# EAGLE design Duinopeak Shield Bot v0.9 (EAGLE 6.2)
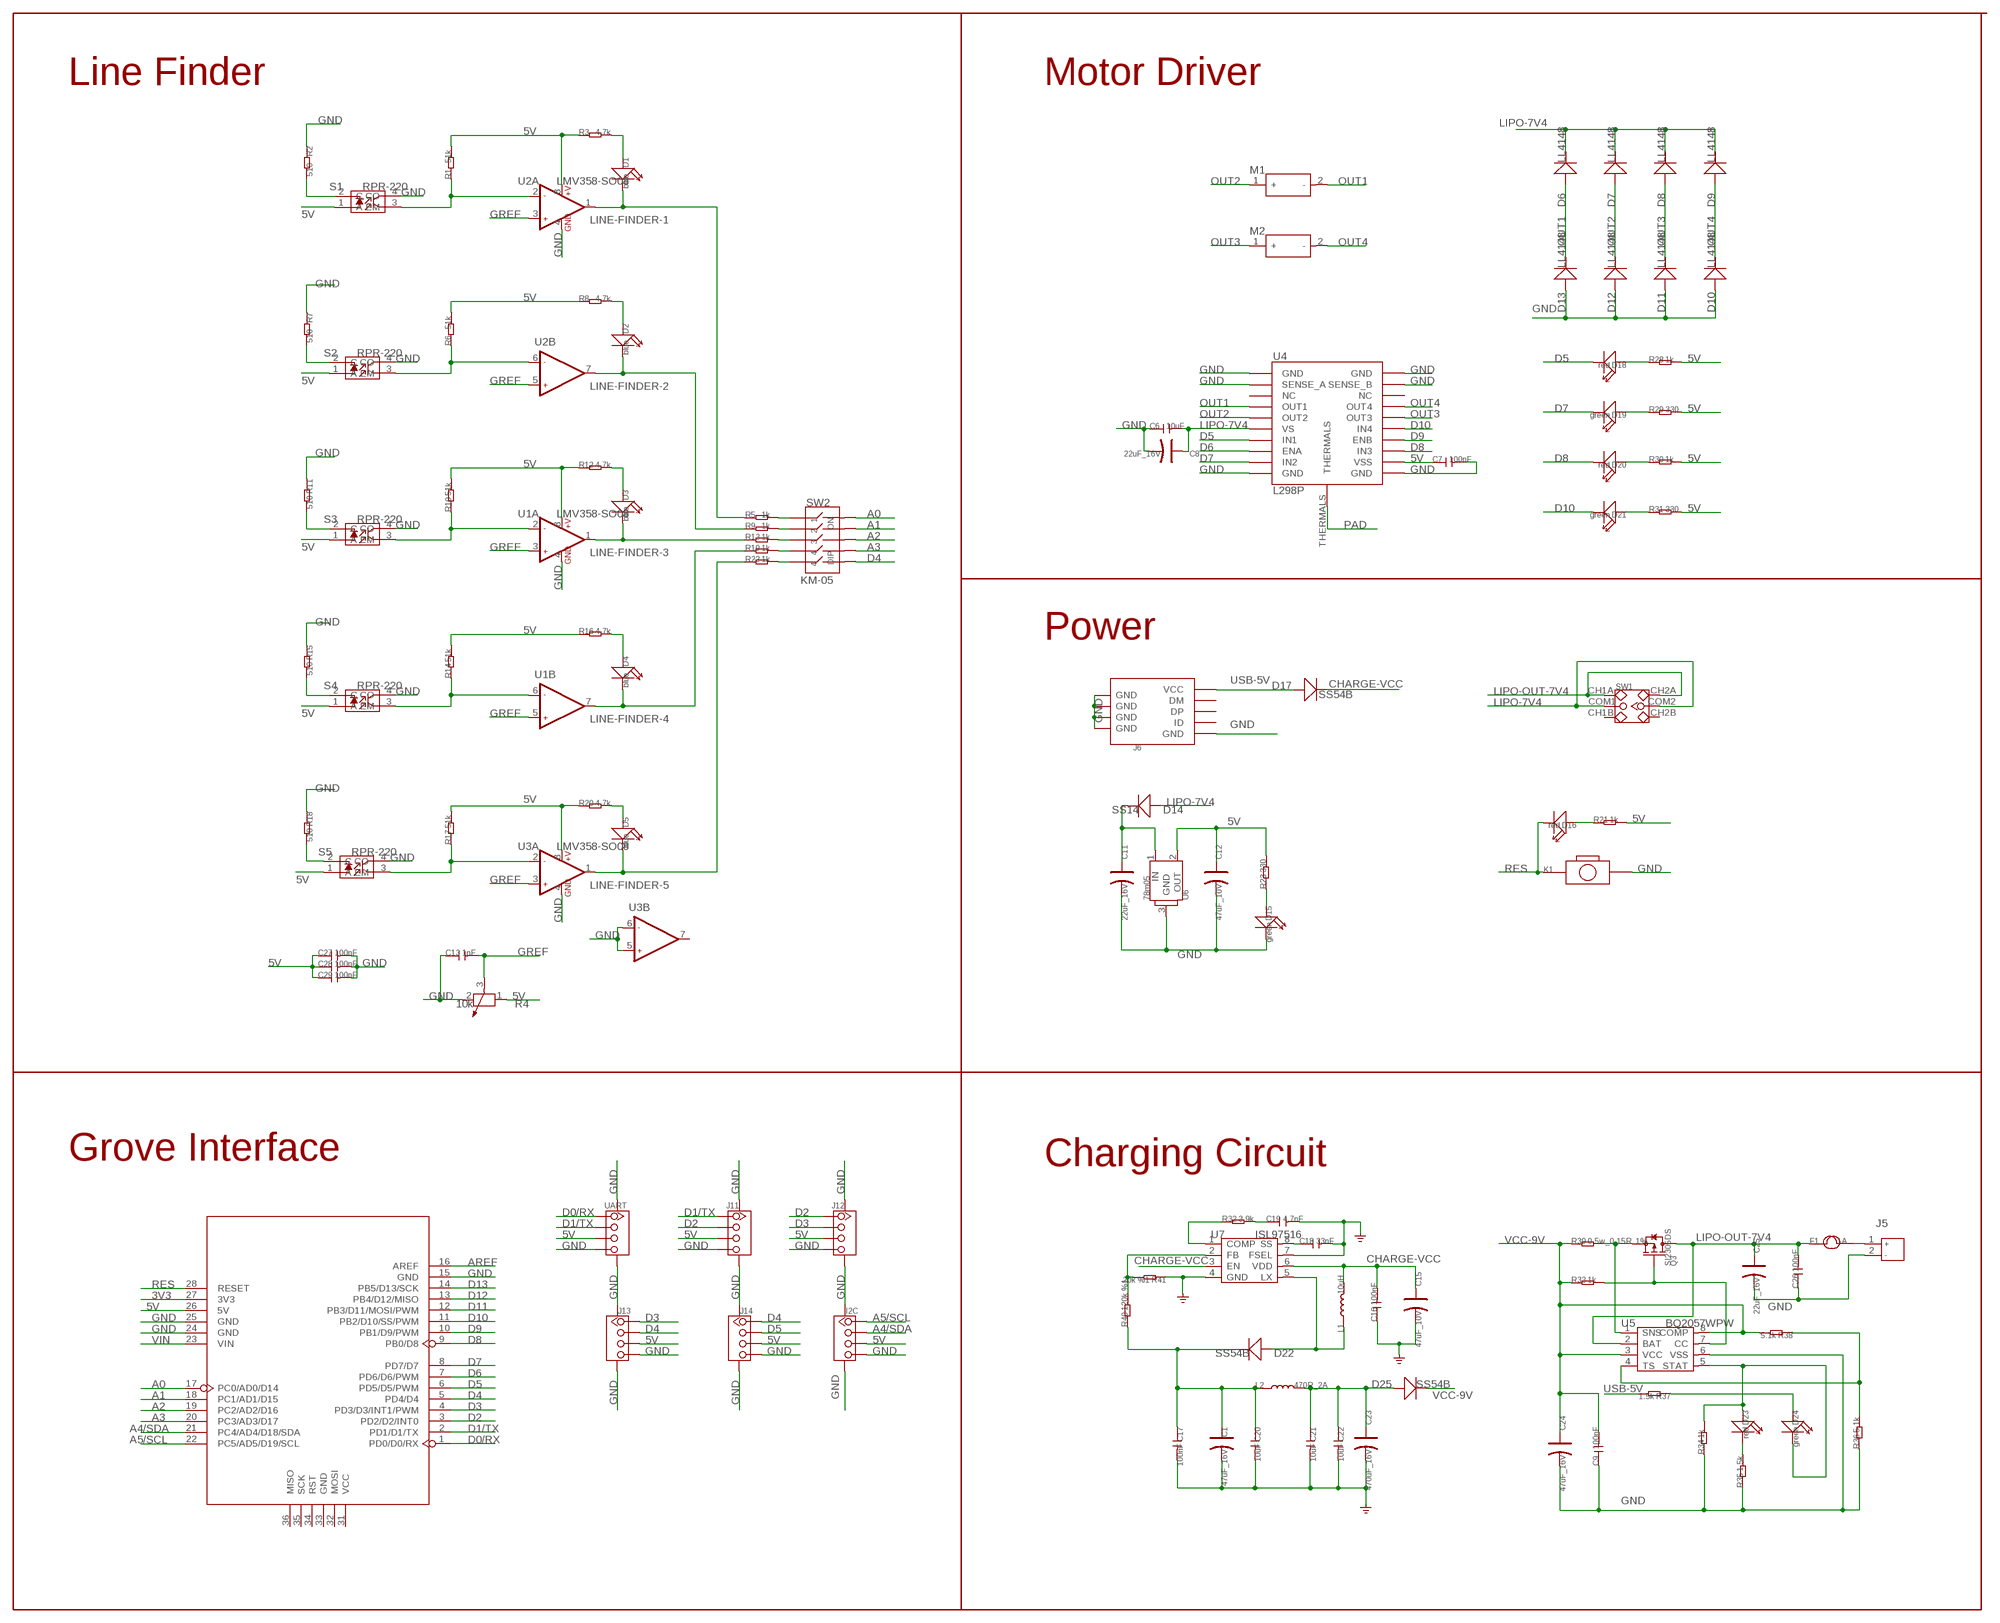
[diagram p0: schematic, sheet 1]

## Parts
C1  47uF_16V  CAP-AVX-C  [AVX-C]
C6  10uF  C-0603  [C0603]
C7  100nF  C-0603  [C0603]
C8  22uF_16V  CAP-AVX-B  [AVX-B]
C9  100nF  C-0603  [C0603]
C11  22uF_16V  CAP-AVX-B  [AVX-B]
C12  47uF_10V  CAP-AVX-B  [AVX-B]
C13  1nF  C-0603  [C0603]
C15  47uF_10V  CAP-AVX-B  [AVX-B]
C16  100nF  C-0603  [C0603]
C17  100nF  C-0603  [C0603]
C18  33nF  C-0603  [C0603]
C19  4.7nF  C-0603  [C0603]
C20  10uF  C-0603  [C0603]
C21  10uF  C-0603  [C0603]
C22  10uF  C-0603  [C0603]
C23  470uF_16V  CAP-AVX-E  [AVX-E]
C24  47uF_16V  CAP-AVX-C  [AVX-C]
C25  22uF_16V  CAP-AVX-B  [AVX-B]
C26  100nF  C-0603  [C0603]
C27  100nF  C-0603  [C0603]
C28  100nF  C-0603  [C0603]
C29  100nF  C-0603  [C0603]
D1  blue  LED'0603'  [LED-0603]
D2  blue  LED'0603'  [LED-0603]
D3  blue  LED'0603'  [LED-0603]
D4  blue  LED'0603'  [LED-0603]
D5  blue  LED'0603'  [LED-0603]
D6  LL4148  D'1206'  [SOD123]
D7  LL4148  D'1206'  [SOD123]
D8  LL4148  D'1206'  [SOD123]
D9  LL4148  D'1206'  [SOD123]
D10  LL4148  D'1206'  [SOD123]
D11  LL4148  D'1206'  [SOD123]
D12  LL4148  D'1206'  [SOD123]
D13  LL4148  D'1206'  [SOD123]
D14  SS14  D'SMA'  [D2010]
D15  green  LED'0603'  [LED-0603]
D16  red  LED'0603'  [LED-0603]
D17  SS54B  D'MBRS240LT3'  [SMB]
D18  red  LED'0603'  [LED-0603]
D19  green  LED'0603'  [LED-0603]
D20  red  LED'0603'  [LED-0603]
D21  green  LED'0603'  [LED-0603]
D22  SS54B  D'MBRS240LT3'  [SMB]
D23  red  LED'0603'  [LED-0603]
D24  green  LED'0603'  [LED-0603]
D25  SS54B  D'MBRS240LT3'  [SMB]
F1  1A  FUSE  [1812]
I2C  TWIG-4P-2.0-SMD-FEMALE-REINFORCE'90D'  [4P-SMD-2.0-90D]
J5  JACK-JST-2P-PW'2.0'  [JST-2.0]
J6  USB-MINIUSB-5P-STRONG  [MINI-SMD-5P]
J11  TWIG-4P-2.0-SMD-FEMALE-REINFORCE'90D'  [4P-SMD-2.0-90D]
J12  TWIG-4P-2.0-SMD-FEMALE-REINFORCE'90D'  [4P-SMD-2.0-90D]
J13  TWIG-4P-2.0-SMD-FEMALE-REINFORCE'90D'  [4P-SMD-2.0-90D]
J14  TWIG-4P-2.0-SMD-FEMALE-REINFORCE'90D'  [4P-SMD-2.0-90D]
K1  BOTTON-2P-90D  [2P-7.62X3.56-90D]
L1  10uH  L'IHLP-2525BD-01'  [2626]
L2  470R_2A  L'0805'  [L0805]
M1  MOTOR-2P-PAD  [2P-SMD-27X26]
M2  MOTOR-2P-PAD  [2P-SMD-27X26]
Q3  SI2305DS  MOSFET-P'SI2323CDS/SI2305DS<BR>'  [SOT23]
R1  51k  R-0603  [R0603]
R2  510  R-0603  [R0603]
R3  4.7k  R-0603  [R0603]
R4  10k  R-POTENTIOMETER'3362'  [3P-SQUA-7X6.8]
R5  1k  R-0603  [R0603]
R6  51k  R-0603  [R0603]
R7  510  R-0603  [R0603]
R8  4.7k  R-0603  [R0603]
R9  1k  R-0603  [R0603]
R10  51k  R-0603  [R0603]
R11  510  R-0603  [R0603]
R12  4.7k  R-0603  [R0603]
R13  1k  R-0603  [R0603]
R14  51k  R-0603  [R0603]
R15  510  R-0603  [R0603]
R16  4.7k  R-0603  [R0603]
R17  51k  R-0603  [R0603]
R18  510  R-0603  [R0603]
R19  1k  R-0603  [R0603]
R20  4.7k  R-0603  [R0603]
R21  1k  R-0603  [R0603]
R22  1k  R-0603  [R0603]
R23  330  R-0603  [R0603]
R28  1k  R-0603  [R0603]
R29  330  R-0603  [R0603]
R30  1k  R-0603  [R0603]
R31  330  R-0603  [R0603]
R32  3.9k  R-0603  [R0603]
R33  1k  R-0603  [R0603]
R34  1k  R-0603  [R0603]
R35  1.5k  R-0603  [R0603]
R36  5.1k  R-0603  [R0603]
R37  1.5k  R-0603  [R0603]
R38  5.1k  R-0603  [R0603]
R39  0.5w_0.15R 1%  R-2512  [R2512]
R40  120k %1  R-0603  [R0603]
R41  20k %1  R-0603  [R0603]
S1  RPR-220  REFLECTIVE-PHOTOSENSOR-RPR-220  [4P-6.4X4.9X6.5H]
S2  RPR-220  REFLECTIVE-PHOTOSENSOR-RPR-220  [4P-6.4X4.9X6.5H]
S3  RPR-220  REFLECTIVE-PHOTOSENSOR-RPR-220  [4P-6.4X4.9X6.5H]
S4  RPR-220  REFLECTIVE-PHOTOSENSOR-RPR-220  [4P-6.4X4.9X6.5H]
S5  RPR-220  REFLECTIVE-PHOTOSENSOR-RPR-220  [4P-6.4X4.9X6.5H]
SW1  SWITCH-2CH-6P'90D'  [6P-2CH-2.54-9.0X3.6-90D]
SW2  KM-05  SWITCH-KM-05-10P  [10P-SMD-14.2X6.8]
U1  LMV358-SO08  [SO08]
U2  LMV358-SO08  [SO08]
U3  LMV358-SO08  [SO08]
U4  L298P  L298_BRIDGE_DRIVER  [POWERSO20]
U5  BQ2057WPW  [TSSOP8]
U6  78m05  78M05-TO252  [TO252]
U7  ISL97516  [MSOP8]
U13  ARDUINO  [ARDUINO]
UART  TWIG-4P-2.0-SMD-FEMALE-REINFORCE'90D'  [4P-SMD-2.0-90D]

## Nets
3V3: U13.27(3V3)
5V: C7.1 C12.+ C27.1 C28.1 C29.1 I2C.3 J11.3 J12.3 J13.3 J14.3 R1.2 R3.1 R4.1 R6.2 R8.1 R10.2 R12.1 R14.2 R16.1 R17.2 R20.1 R21.2 R23.2 R28.2 R29.2 R30.2 R31.2 S1.1(A) S2.1(A) S3.1(A) S4.1(A) S5.1(A) U1.8(A:+V) U2.8(A:+V) U3.8(A:+V) U4.P$12(VSS) U6.2(OUT) U13.26(5V) UART.3
A0: SW2.10 U13.17(PC0/AD0/D14)
A1: SW2.9 U13.18(PC1/AD1/D15)
A2: SW2.8 U13.19(PC2/AD2/D16)
A3: SW2.7 U13.20(PC3/AD3/D17)
A4/SDA: I2C.2 U13.21(PC4/AD4/D18/SDA)
A5/SCL: I2C.1 U13.22(PC5/AD5/D19/SCL)
AREF: U13.16(AREF)
CHARGE-VCC: C15.+ C16.2 D17.- L1.2 U7.3(EN) U7.6(VDD)
D0/RX: U13.1(PD0/D0/RX) UART.1
D1/TX: J11.1 U13.2(PD1/D1/TX) UART.2
D2: J11.2 J12.1 U13.3(PD2/D2/INT0)
D3: J12.2 J13.1 U13.4(PD3/D3/INT1/PWM)
D4: J13.2 J14.1 SW2.6 U13.5(PD4/D4)
D5: D18.- J14.2 U4.P$7(IN1) U13.6(PD5/D5/PWM)
D6: U4.P$8(ENA) U13.7(PD6/D6/PWM)
D7: D19.- U4.P$9(IN2) U13.8(PD7/D7)
D8: D20.- U4.P$13(IN3) U13.9(PB0/D8)
D9: U4.P$14(ENB) U13.10(PB1/D9/PWM)
D10: D21.- U4.P$15(IN4) U13.11(PB2/D10/SS/PWM)
D11: U13.12(PB3/D11/MOSI/PWM)
D12: U13.13(PB4/D12/MISO)
D13: U13.14(PB5/D13/SCK)
GND: C1.- C6.1 C7.2 C8.- C9.1 C11.- C12.- C13.1 C15.- C16.1 C17.2 C18.2 C19.2 C20.2 C21.2 C22.2 C23.- C24.- C25.- C26.1 C27.2 C28.2 C29.2 D10.+ D11.+ D12.+ D13.+ D15.- I2C.4 I2C.SS1 I2C.SS2 J5.2 J6.5(GND) J6.GND@1(GND) J6.GND@2(GND) J6.GND@3(GND) J6.GND@4(GND) J11.4 J11.SS1 J11.SS2 J12.4 J12.SS1 J12.SS2 J13.4 J13.SS1 J13.SS2 J14.4 J14.SS1 J14.SS2 K1.P$2 R2.1 R4.2 R7.1 R11.1 R15.1 R18.1 R34.1 R35.1 R36.1 R41.1 S1.4(CO) S2.4(CO) S3.4(CO) S4.4(CO) S5.4(CO) U1.4(A:GND) U2.4(A:GND) U3.4(A:GND) U3.5(B:+IN2) U3.6(B:-IN2) U4.P$1(GND) U4.P$2(SENSE_A) U4.P$10(GND) U4.P$11(GND) U4.P$19(SENSE_B) U4.P$20(GND) U5.6(VSS) U6.3(GND) U7.4(GND) U7.7(FSEL) U13.15(GND) U13.24(GND) U13.25(GND) UART.4 UART.SS1 UART.SS2
GREF: C13.2 R4.3 U1.3(A:+IN1) U1.5(B:+IN2) U2.3(A:+IN1) U2.5(B:+IN2) U3.3(A:+IN1)
LINE-FINDER-1: D1.- R5.1 U2.1(A:OUT1)
LINE-FINDER-2: D2.- R9.1 U2.7(B:OUT2)
LINE-FINDER-3: D3.- R13.1 U1.1(A:OUT1)
LINE-FINDER-4: D4.- R19.1 U1.7(B:OUT2)
LINE-FINDER-5: D5.- R22.1 U3.1(A:OUT1)
LIPO-7V4: C6.2 C8.+ D6.- D7.- D8.- D9.- D14.+ SW1.COM1 SW1.COM2 U4.P$6(VS)
LIPO-OUT-7V4: C25.+ C26.2 F1.1 Q3.3(D) SW1.CH1A SW1.CH2A U5.2(BAT)
N$1: D18.+ R28.1
N$2: R1.1 S1.3(EM) U2.2(A:-IN1)
N$3: R6.1 S2.3(EM) U2.6(B:-IN2)
N$4: D2.+ R8.2
N$5: R2.2 S1.2(C)
N$6: R7.2 S2.2(C)
N$7: D19.+ R29.1
N$8: R10.1 S3.3(EM) U1.2(A:-IN1)
N$9: D3.+ R12.2
N$10: R11.2 S3.2(C)
N$11: D20.+ R30.1
N$12: D1.+ R3.2
N$13: R15.2 S4.2(C)
N$14: D4.+ R16.2
N$15: R5.2 SW2.1
N$16: F1.2 J5.1
N$17: R9.2 SW2.2
N$18: D5.+ R20.2
N$19: R18.2 S5.2(C)
N$20: R17.1 S5.3(EM) U3.2(A:-IN1)
N$21: R13.2 SW2.3
N$22: R19.2 SW2.4
N$23: R22.2 SW2.5
N$25: D16.+ R21.1
N$28: D21.+ R31.1
N$31: D15.+ R23.1
N$32: Q3.2(S) R39.2 U5.1(SNS)
N$33: R14.1 S4.3(EM) U1.6(B:-IN2)
N$35: Q3.1(G) R33.2 U5.7(CC)
N$36: D23.- R35.2
N$37: R36.2 R38.1 U5.4(TS)
N$38: D23.+ D24.- R34.2 U5.5(STAT)
N$39: D24.+ R37.1
N$41: C18.1 U7.8(SS)
N$42: R40.2 R41.2 U7.2(FB)
N$43: D22.+ L1.1 U7.5(LX)
N$44: R32.1 U7.1(COMP)
N$45: C19.1 R32.2
N$50: C11.+ D14.- U6.1(IN)
OUT1: D6.+ D13.- M1.2(-) U4.P$4(OUT1)
OUT2: D7.+ D12.- M1.1(+) U4.P$5(OUT2)
OUT3: D8.+ D11.- M2.1(+) U4.P$16(OUT3)
OUT4: D9.+ D10.- M2.2(-) U4.P$17(OUT4)
OUTPUT: C1.+ C17.1 C20.1 D22.- L2.1 R40.1
OUTPUT2: C21.1 C22.1 C23.+ D25.+ L2.2
PAD: U4.THERMALS
RES: D16.- K1.P$1 U13.28(RESET)
USB-5V: D17.+ J6.1(VCC) R37.2
VCC-9V: C9.2 C24.+ D25.- R33.1 R38.2 R39.1 U5.3(VCC) U5.8(COMP)
VIN: U13.23(VIN)
Unconnected: J6.2(DM) J6.3(DP) J6.4(ID) SW1.CH1B SW1.CH2B U3.7(B:OUT2) U4.P$3(NC) U4.P$18(NC) U13.31(VCC) U13.32(MOSI) U13.33(GND) U13.34(RST) U13.35(SCK) U13.36(MISO)

## Notes on the sheet
- Line Finder | Motor Driver
- Power
- Grove Interface | Charging Circuit

## Library data of the parts
C1 C8 C11 C12 C15 C23-C25 = Discrete:CAP*: Electrolytic Capacitors,Tantalum Capacitors and Super Capacitors
C6 C7 C9 C13 C16-C22 C26-C29 = Discrete:C*: Ceramic Capacitors
D1-D5 D15 D16 D18-D21 D23 D24 = Discrete:LED*
D6-D14 D17 D22 D25 = Discrete:D*
F1 = Discrete:FUSE
I2C J11-J14 UART = Connector:TWIG-4P-2.0-SMD-FEMALE-REINFORCE
J5 = Connector:JACK-JST-2P-PW
J6 = Connector:USB-MINIUSB-5P
K1 = Discrete:BOTTON-2P
L1 L2 = Discrete:L*
M1 M2 = template:MOTOR-2P-PAD
Q3 = Discrete:MOSFET-P
R1-R3 R5-R23 R28-R41 = Discrete:R*
R4 = Discrete:R-POTENTIOMETER*: Potentiometer
S1-S5 = Discrete:REFLECTIVE-PHOTOSENSOR-RPR-220: http://wenku.baidu.com/view/18864e7d27284b73f24250aa.html
SW1 = Discrete:SWITCH-2CH-6P
SW2 = template:SWITCH-KM-05-10P
U1-U3 = IC:LMV358: General purpose LOW Voltage, Rail-to-Rail Output Amplifiers http://www.fairchildsemi.com/ds/LM/LMV358.pdf
U4 = ICs:L298_BRIDGE_DRIVER
U5 = template:BQ2057W: Advanced Linear Charge Management IC For Single-AND TWO-CELL Lithium-Ion And Lithium-Polymer
U6 = IC:78M05: 0.5A Three Terminal Positive Voltage Regulators http://pdf1.alldatasheet.com/datasheet-pdf/view/31368/TOSHIBA/78M05/+21_79UPLRhpDDdCDytD+/datasheet.pdf
U7 = IC:ISL97516
U13 = moudle:ARDUINO

## Net classes
0 default: width 0.203 mm, drill 0.305 mm, clearance 0.127 mm

## Board
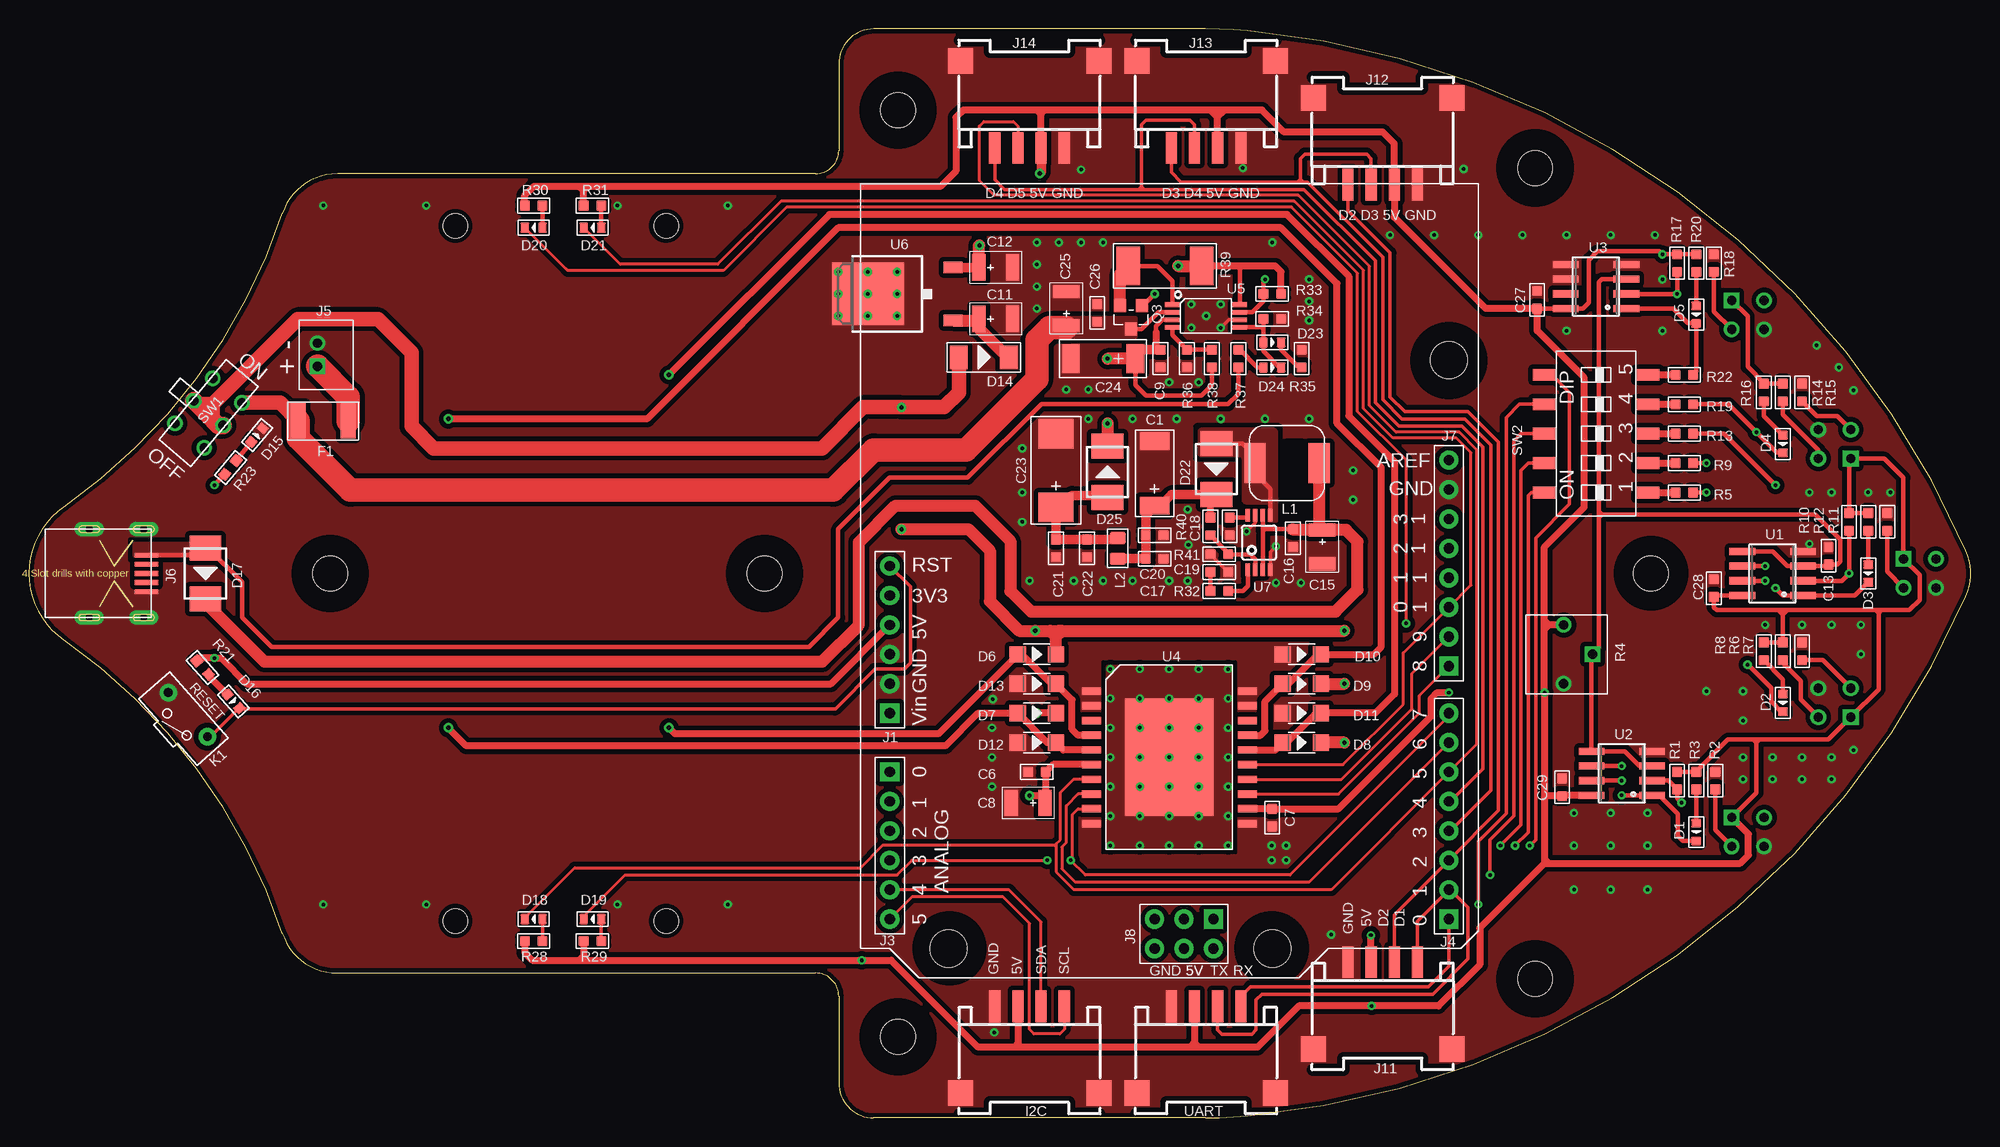
[diagram p1: board, top side]
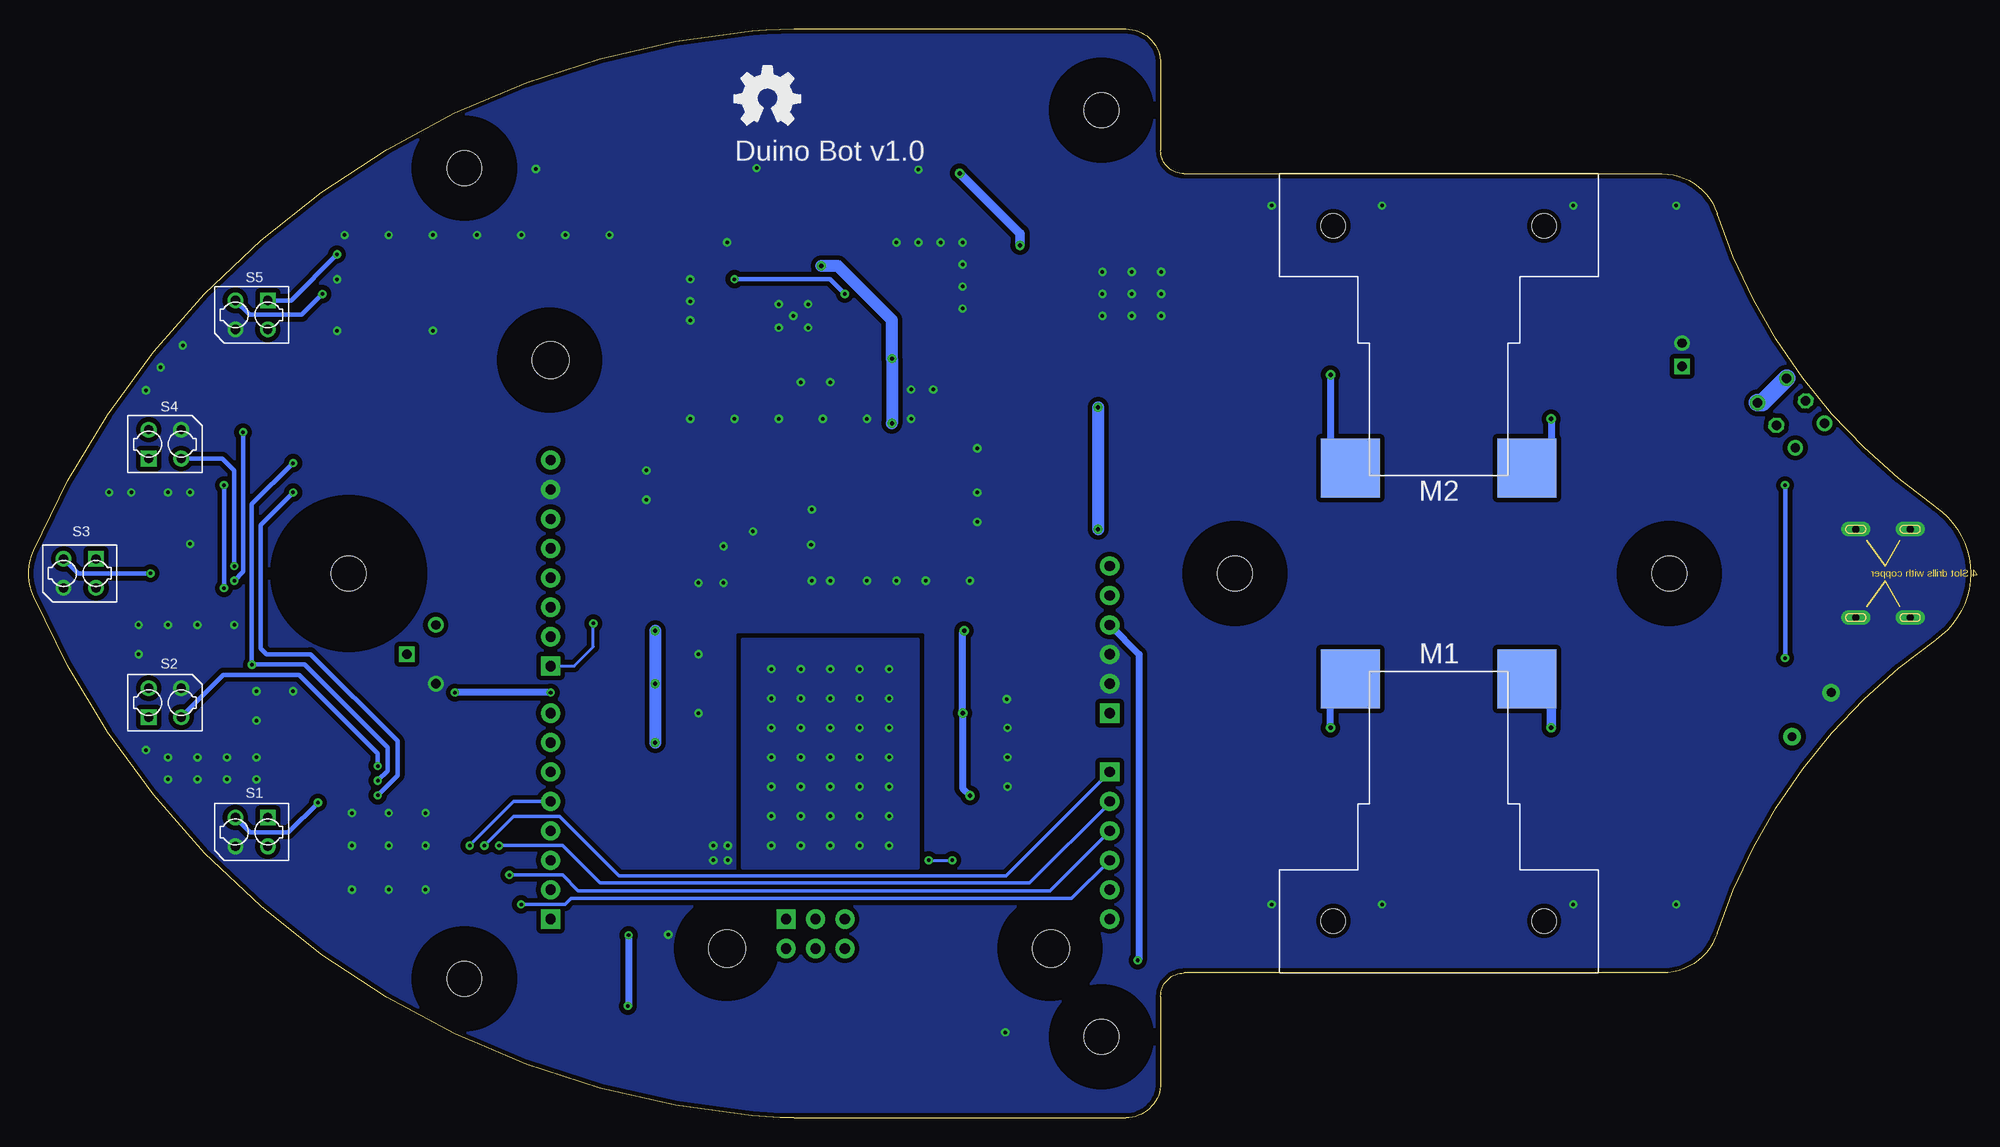
[diagram p2: board, bottom side, seen from below]

Size 167.58 x 94 mm. Coordinates in mm from the lower left corner, seen from the top.
Outline: 67.9,81.5 26.62,81.5 arc72 21.88,78.07 arc-37 3,52.74 arc110 3,41.26 arc-37 21.88,15.93 arc72 26.62,12.5 67.9,12.5 arc-90 69.9,10.5 69.9,3 arc90 72.9,0 101.53,0 arc5 105.15,0.16 arc61 167.17,45.01 arc47 167.17,48.99 arc61 105.15,93.84 arc5 101.53,94 72.9,94 arc90 69.9,91 69.9,83.5 arc-90 67.9,81.5
Copper layers (1*16): Top 0.035mm / dielectric 1.5mm / Bottom 0.035mm
Design rules "default": minimum track width 10mil, minimum drill 12mil, track to track 8mil, track to pad 8mil, pad to pad 8mil, via to via 8mil, smd to smd 0mil, copper to edge 10mil, drill to drill 8mil, minimum pad ring 10mil, minimum via ring 8mil, stop-mask expansion 4mil, vias tented up to drill 100mil, thermal gap 10mil
Holes 2.1 mm at 36.8,77 55,77 36.8,17 55,17
Holes 3 mm at 26,47 63.5,47 75,87 130,82 130,12 75,7 140,47
tRestrict: area 137.2,44.2 to 142.8,49.8; area 60.7,44.2 to 66.3,49.8; area 72.2,4.2 to 77.8,9.8; area 127.2,9.2 to 132.8,14.8; area 72.2,84.2 to 77.8,89.8; area 127.2,79.2 to 132.8,84.8; area 23.2,44.2 to 28.8,49.8; area 76.8,12 to 82.1,17.3; area 104.6,12 to 109.9,17.3; area 119.8,62.6 to 125.4,68.2; area 108.6,51.9 to 109.9,58.2
bRestrict: area 133.6,40.6 to 146.3,53.3; area 22,43 to 30,51; area 71,83 to 79,91; area 126,78 to 134,86; area 59.5,43 to 67.5,51; area 71,3 to 79,11; area 126,8 to 134,16; area 75.4,10.6 to 83.4,18.6; area 103.4,10.6 to 111.4,18.6; area 118.6,61.4 to 126.6,69.4

### Footprints (pad centres in the part's own frame; a part is rotated, then mirrored left to right if it is on the bottom)
AVX-C = smd 1.524 x 2.54: + -2.794,0; - 2.794,0
C0603 = smd 0.889 x 0.889: 1 -0.762,0; 2 0.762,0
AVX-B = smd 1.143 x 2.286: + -1.46,0; - 1.46,0
AVX-E = smd 2.54 x 3.048: + -3.175,0; - 3.175,0
LED-0603 = smd 0.762 x 0.889: + -0.762,0; - 0.762,0
SOD123 = smd 1.397 x 1.397: + -1.651,0; - 1.651,0
D2010 = smd 1.524 x 2.032: + -2.159,0; - 2.159,0
SMB = smd 2.159 x 2.743: + -2.21,0; - 2.21,0
1812 = smd 1.27 x 3.048: 1 -2.159,0; 2 2.159,0
4P-SMD-2.0-90D = smd 0.965 x 2.74: 1 -3,-0.1; 2 -1,-0.1; 3 1,-0.1; 4 3,-0.1 | smd 2.159 x 2.184: SS1 -5.974,7.4; SS2 5.974,7.4
JST-2.0 = drill 0.8 pad 1.3 square: 1 -1,0.75 | drill 0.8 pad 1.3: 2 1,0.75
MINI-SMD-5P = smd 2.032 x 0.406: 1 0.381,-1.575; 2 0.381,-0.787; 3 0.381,0; 4 0.381,0.787; 5 0.381,1.575 | drill 0.635 pad 1.27 long: GND@1 0.635,3.81; GND@2 5.334,3.81; GND@3 5.334,-3.81; GND@4 0.635,-3.81
2P-7.62X3.56-90D = drill 0.762 pad 1.524: P$1 0,2.54; P$2 0,-2.54
2626 = smd 1.829 x 3.429: 1 -2.769,0; 2 2.769,0
L0805 = smd 1.016 x 1.397: 1 -0.889,0; 2 0.889,0
2P-SMD-27X26 = smd 5.08 x 5.08: 1 7.62,25.4; 2 -7.62,25.4
SOT23 = smd 1.016 x 1.143: 1 -0.95,-1.016; 2 0.95,-1.016; 3 0,1.016
R0603 = smd 0.889 x 0.889: 1 -0.762,0; 2 0.762,0
3P-SQUA-7X6.8 = drill 0.8 pad 1.35: 1 -2.54,-0.25; 2 2.54,-0.25 | drill 0.8 pad 1.35 square: 3 0,2.25
R2512 = smd 2.032 x 3.302: 1 -3.175,0; 2 3.175,0
4P-6.4X4.9X6.5H = drill 0.8 pad 1.35 square: 1 -1.4,-1.25 | drill 0.8 pad 1.35: 2 -1.4,1.25; 3 1.4,-1.25; 4 1.4,1.25
6P-2CH-2.54-9.0X3.6-90D = drill 0.813 pad 1.27: CH1A -2.54,-1.65; CH1B 2.54,-1.65; CH2A -2.54,1.65; CH2B 2.54,1.65 | drill 0.813 pad 1.27 octagon: COM1 0,-1.65; COM2 0,1.65
10P-SMD-14.2X6.8 = smd 1.016 x 2.032: 1 -5.08,-4.445; 2 -2.54,-4.445; 3 0,-4.445; 4 2.54,-4.445; 5 5.08,-4.445; 6 5.08,4.445; 7 2.54,4.445; 8 0,4.445; 9 -2.54,4.445; 10 -5.08,4.445
SO08 = smd 0.61 x 2.21: 1 -1.905,-2.616; 2 -0.635,-2.616; 3 0.635,-2.616; 4 1.905,-2.616; 5 1.905,2.616; 6 0.635,2.616; 7 -0.635,2.616; 8 -1.905,2.616
POWERSO20 = smd 1.651 x 0.635: P$1 -6.731,5.715; P$2 -6.731,4.445; P$3 -6.731,3.175; P$4 -6.731,1.905; P$5 -6.731,0.635; P$6 -6.731,-0.635; P$7 -6.731,-1.905; P$8 -6.731,-3.175; P$9 -6.731,-4.445; P$10 -6.731,-5.715; P$11 6.731,-5.715; P$12 6.731,-4.445; P$13 6.731,-3.175; P$14 6.731,-1.905; P$15 6.731,-0.635; P$16 6.731,0.635; P$17 6.731,1.905; P$18 6.731,3.175; P$19 6.731,4.445; P$20 6.731,5.715 | smd 7.62 x 10.16: THERMALS 0,0
TSSOP8 = smd 0.4 x 1.27: 1 -0.975,-2.9; 2 -0.325,-2.9; 3 0.325,-2.9; 4 0.975,-2.9; 5 0.975,2.9; 6 0.325,2.9; 7 -0.325,2.9; 8 -0.975,2.9
TO252 = smd 1.016 x 1.651: 1 -2.286,-4.826; 2 2.286,-4.826 | smd 5.4 x 6.2: 3 0,2.5
MSOP8 = smd 0.4 x 1.1: 1 -0.975,-2.35; 2 -0.325,-2.35; 3 0.325,-2.35; 4 0.975,-2.35; 5 0.975,2.35; 6 0.325,2.35; 7 -0.325,2.35; 8 -0.975,2.35
ARDUINO = drill 0.889 pad 1.651 square: 1 63.5,50.8; 9 41.656,50.8; 17 50.8,2.54; 23 45.72,2.54; 36 63.5,30.48 | drill 0.889 pad 1.651: 2 60.96,50.8; 3 58.42,50.8; 4 55.88,50.8; 5 53.34,50.8; 6 50.8,50.8; 7 48.26,50.8; 8 45.72,50.8; 10 39.116,50.8; 11 36.576,50.8; 12 34.036,50.8; 13 31.496,50.8; 14 28.956,50.8; 15 26.416,50.8; 16 23.876,50.8; 18 53.34,2.54; 19 55.88,2.54; 20 58.42,2.54; 21 60.96,2.54; 22 63.5,2.54; 24 43.18,2.54; 25 40.64,2.54; 26 38.1,2.54; 27 35.56,2.54; 28 33.02,2.54; 31 66.04,30.48; 32 66.04,27.94; 33 66.04,25.4; 34 63.5,25.4; 35 63.5,27.94 | hole 3.2: 15.24,50.8; 66.04,35.56; 66.04,7.62

### Placement (x,y rotation side)
C1  97.15,55.64 90 top
C6  86.99,29.85 0 top
C7  107.31,25.92 270 top
C8  86.23,27.19 180 top
C9  97.66,65.54 90 top
C11  83.44,68.97 0 top
C12  83.44,73.42 0 top
C13  155.32,48.52 270 top
C15  111.63,49.29 270 top
C16  109.09,50.05 90 top
C17  97.15,48.27 0 top
C18  103.63,51.06 270 top
C19  102.74,47.13 0 top
C20  97.15,50.3 0 top
C21  88.64,49.16 270 top
C22  91.31,49.16 270 top
C23  88.64,55.89 90 top
C24  92.71,65.54 180 top
C25  89.53,69.86 90 top
C26  92.2,69.48 270 top
C27  130.17,70.62 90 top
C28  145.41,45.73 90 top
C29  132.33,28.54 90 top
D1  143.91,24.66 270 top
D2  151.38,35.82 270 top
D3  158.75,47 270 top
D4  151.38,58.18 270 top
D5  143.91,69.34 270 top
D6  86.99,40.01 0 top
D7  86.99,34.93 0 top
D8  109.85,32.39 0 top
D9  109.85,37.47 0 top
D10  109.85,40.01 0 top
D11  109.85,34.93 0 top
D12  86.99,32.39 0 top
D13  86.99,37.47 0 top
D14  82.42,65.67 0 top
D15  19.68,58.94 50 top
D16  17.65,35.95 311.5 top
D17  15.24,47 270 top
D18  43.56,17.15 180 top
D19  48.64,17.15 180 top
D20  43.56,76.84 180 top
D21  48.64,76.84 180 top
D22  102.49,56.02 270 top
D23  107.31,66.94 0 top
D24  107.31,64.78 0 top
D25  93.09,55.76 90 top
F1  25.4,60.16 0 top
I2C  86.36,9.53 180 top
J5  25.65,65.87 90 top
J6  10.54,47 180 top
J11  116.84,13.34 180 top
J12  116.84,80.65 0 top
J13  101.6,83.83 0 top
J14  86.36,83.83 0 top
K1  13.71,34.81 221.5 top
L1  108.58,56.52 0 top
L2  93.98,49.16 90 top
M1  45.9,12.5 0 bottom
M2  45.9,81.5 180 bottom
Q3  95.12,69.1 180 top
R1  142.25,29.11 90 top
R2  145.56,29.11 270 top
R3  143.91,29.11 270 top
R4  132.71,40.01 270 top
R5  142.87,53.98 180 top
R6  151.38,40.27 90 top
R7  153.03,40.27 270 top
R8  149.73,40.27 270 top
R9  142.87,56.52 180 top
R10  157.1,51.44 90 top
R11  160.4,51.44 270 top
R12  158.75,51.44 270 top
R13  142.87,59.06 180 top
R14  151.38,62.62 90 top
R15  153.03,62.62 270 top
R16  149.73,62.62 270 top
R17  142.25,73.78 90 top
R18  145.43,73.78 270 top
R19  142.87,61.6 180 top
R20  143.91,73.78 270 top
R21  14.98,38.87 131.5 top
R22  142.87,64.14 180 top
R23  17.4,56.14 230 top
R28  43.56,15.25 180 top
R29  48.64,15.25 180 top
R30  43.56,78.75 180 top
R31  48.64,78.75 180 top
R32  102.74,45.48 180 top
R33  107.31,71.13 180 top
R34  107.31,68.97 180 top
R35  109.85,65.54 270 top
R36  99.95,65.54 90 top
R37  104.39,65.54 270 top
R38  102.11,65.54 270 top
R39  98.04,73.54 180 top
R40  101.98,51.06 270 top
R41  102.74,48.65 0 top
S1  148.37,24.68 180 bottom
S2  155.84,35.84 0 bottom
S3  163.19,47 180 bottom
S4  155.84,58.16 0 bottom
S5  148.37,69.32 180 bottom
SW1  15.49,60.84 230 top
SW2  135.25,59.06 90 top
U1  150.49,47 90 top
U2  137.48,29.74 90 top
U3  135.25,71.76 90 top
U4  98.42,31.12 0 top
U5  101.6,69.22 270 top
U6  74.93,71.13 90 top
U7  106.17,49.67 0 top
U13  71.75,80.65 270 top
U$2  [OSHW_FILLX200_NOTEXT]  106.68,85.73 0 bottom
UART  101.6,9.53 180 top

### Tracks (layer width: path | path; a pad name or v marks a point on that pad's centre or on a via)
5V  (via drill 0.3 pad 0.64, 0.38 pad 0.81)
  Top 0.406: R23.2 16.91,55.53 v16,54.62 | R20.1 R17.2 v140.98,74.54 140.71,74.81 135.38,74.81 134.62,74.05 134.62,70.37 134.11,69.86 U3.8 C27.1 | R14.2 R16.1 149.73,63.45 148.33,64.84 148.33,69.2 S5.1 | R12.1 R10.2 | 156.97,52.21 R10.2 | 151,43.82 145.67,43.82 145.41,44.08 C28.1 145.54,45.09 U1.8 | 151,43.82 151.38,43.82 | 151.38,43.82 151.76,43.82 | 151.76,43.82 159.38,43.82 | 159.38,43.82 159.51,43.82 | 159.51,43.82 159.89,43.82 | 159.89,43.82 162.3,43.82 163.19,44.71 163.19,46.85 S3.1 161.79,55.26 160.15,56.91 S4.1 157.1,56.76 R10.2 | R8.1 R6.2 151.38,43.44 | 159.64,43.57 159.64,36.98 S2.1 155.3,32.65 149.35,32.65 | 159.64,43.57 159.64,43.7 159.51,43.82 | R1.2 R3.1 143.91,29.92 146.63,32.65 148.84,32.65 | 159.64,43.57 159.38,43.82 | 159.64,43.57 159.89,43.82 | 151.38,43.44 151.38,43.82 | 151.38,43.44 151,43.82 | 151.38,43.44 151.76,43.82 | 148.84,32.65 148.97,32.65 | 148.97,32.65 149.35,32.65 | 149.1,32.39 149.1,32.52 148.97,32.65 | 149.1,32.39 148.84,32.65 | 149.1,32.39 149.35,32.65 | 149.1,32.39 149.1,28.06 S1.1
  Top 0.61: J13.3 102.6,86.39 | 102.6,86.39 101.98,87 | 101.98,87 87.63,87 | J14.3 87.36,86.64 | 101.98,87 106.42,87 108.33,85.1 116.84,85.1 117.84,84.1 J12.3 117.84,77.75 125.73,69.86 C27.1 130.17,67.95 134.24,63.89 134.24,52.71 130.81,49.29 130.81,42.94 | U4.P$12 C7.1 113.03,26.68 121.03,34.68 121.03,36.2 121.54,36.71 v122.55,36.71 | 130.81,21.98 125.22,16.39 125.22,13.22 121.66,9.66 v115.89,9.66 109.6,9.66 106.04,6.11 100.96,6.11 | 100.96,6.11 100.33,6.11 | 100.33,6.11 100.2,6.11 | 100.2,6.11 85.6,6.11 | I2C.3 85.36,6.38 | UART.3 100.6,6.5 | 100.6,6.47 100.6,6.38 100.33,6.11 | J11.3 115.84,15.74 v115.82,15.76 | 130.81,27.95 v130.81,36.71 130.81,42.17 | 130.81,27.95 130.81,22.36 | 130.81,22.36 130.81,21.98 | R28.2 42.8,14.25 43.45,13.6 47.5,13.6 | 47.5,13.6 47.75,13.6 | 47.75,13.6 48.26,13.6 | 48.26,13.6 v71.88,13.6 74.42,13.6 81.91,6.11 85.09,6.11 | 85.6,6.11 85.34,6.11 | 85.34,6.11 85.09,6.11 | U13.26 69.21,37.47 18.79,37.47 16.57,39.7 v16,39.7 14.73,39.7 R21.2 | R29.2 47.88,13.73 47.75,13.6 | 85.36,6.34 85.36,6.12 85.34,6.11 | 85.36,6.38 85.09,6.11 | 85.36,6.38 85.36,6.34 | 85.36,6.34 85.6,6.11 | 100.6,6.5 100.2,6.11 | 100.6,6.5 100.6,6.47 | 100.6,6.47 100.96,6.11 | 47.5,13.6 47.88,13.98 48.26,13.6 | 87.63,87 86.99,87 | 86.99,87 80.64,87 80.01,86.37 80.01,81.73 78.68,80.4 48.26,80.4 | 48.26,80.4 43.56,80.4 42.8,79.64 R30.2 | R31.2 47.88,80.02 | 47.88,80.02 48.26,80.4 | 47.88,80.02 47.56,80.34 | 87.36,86.64 87.36,86.73 87.63,87 | 87.36,86.64 86.99,87 | 102.6,86.39 102.6,86.42 103.12,86.94 | 130.81,42.17 130.81,42.55 | 130.81,42.55 130.81,42.94 | R4.1 131.19,42.55 | 131.19,42.55 130.81,42.55 | 131.19,42.55 130.81,42.94 | 131.19,42.55 130.81,42.17
  Top 0.61: 130.81,21.98 131.19,21.98 | 131.19,21.98 147.7,21.98 148.4,22.68 148.4,24.5 S1.1 | U2.8 132.4,27.84 C29.1 130.98,27.78 130.81,27.95 | 131.19,21.98 130.81,22.36
  Top 0.813: U6.2 C12.+ | v87.25,81.54 87.37,81.67 87.37,83.71 J14.3
  Top 1.016: C12.+ 81.98,75.26 v82.04,75.32
  Bottom 0.406: v16,54.62 v16,39.7 | S5.1 144.96,70.57 v140.98,74.54
  Bottom 0.61: v122.55,36.71 v130.81,36.71 | v115.82,15.76 115.82,9.72 v115.89,9.66 | U13.26 71.75,40.01 71.75,13.73 v71.88,13.6
  Bottom 0.813: v87.25,81.54 82.04,76.34 v82.04,75.32
  pour Bottom: 74.93,99.07 76.2,99.07 76.2,97.8 74.93,97.8
A0  (via drill 0.3 pad 0.64)
  Top 0.305: SW2.10 129.67,53.98 129.41,53.73 129.41,24.65 v128.27,23.5
  Bottom 0.305: v128.27,23.5 125.73,26.04 121.79,26.04 116.65,20.91 83.24,20.91 U13.17
A1  (via drill 0.3 pad 0.64)
  Top 0.305: v127,23.5 128.78,25.28 128.78,55.89 129.28,56.4 129.41,56.52 SW2.9
  Bottom 0.305: U13.18 74.29,27.19 81.21,20.27 118.3,20.27 121.54,23.5 v127,23.5
A2  (via drill 0.3 pad 0.64)
  Top 0.305: SW2.8 128.78,59.06 128.14,58.43 128.14,26.04 126.11,24.01 v126.11,20.96
  Bottom 0.305: v126.11,20.96 121.54,20.96 120.18,19.61 79.46,19.61 U13.19
A3  (via drill 0.3 pad 0.64)
  Top 0.305: SW2.7 128.65,61.6 127.51,60.46 127.51,26.3 125.09,23.89 v125.09,18.42
  Bottom 0.305: v125.09,18.42 121.28,18.42 120.78,18.93 77.6,18.93 U13.20
A4/SDA
  Top 0.254: I2C.2 87.36,16.92 84.71,19.57 84.58,19.69 U13.21
A5/SCL
  Top 0.254: 89.36,8.9 89.36,7.63 88.98,7.25 86.74,7.25 86.36,7.63 86.36,16.77 84.07,19.06 76.2,19.06 U13.22
  Top 0.305: 89.36,8.9 I2C.1
CHARGE-VCC
  Top 0.406: U7.6 106.5,50.94 | 106.5,50.94 106.5,50.81 | 106.5,50.74 U7.3 | C16.2 106.62,50.81 | 106.62,50.81 106.5,50.94 | 106.55,50.94 106.68,50.81 106.55,50.68 106.5,50.74 | 106.62,50.81 106.5,50.81 | 106.5,50.81 106.5,50.74
  Top 1.016: D17.- 15.24,44.46 20.32,39.38 68.45,39.38 71.63,42.55 71.63,49.67 74.8,52.84 81.66,52.84 84.71,49.79 84.71,45.48 86.49,43.7 112.77,43.7 114.68,45.6 114.68,49.75 113.69,50.75 C15.+ | L1.2 111.35,51.03 C15.+ | C15.+ 109.15,50.75 C16.2
D0/RX
  Top 0.305: UART.1 104.6,10.5 105.41,11.31 120.78,11.31 122.55,13.09 U13.1
D1/TX
  Top 0.305: J11.1 119.84,16.98 U13.2 122.68,19.69 124.2,18.17 124.2,13.73 121.16,10.68 106.42,10.68 105.92,10.17 105.92,7.59 105.54,7.21 102.98,7.21 102.6,7.59 UART.2
D2
  Top 0.305: J12.1 113.84,78.32 117.47,74.69 117.47,62.24 118.74,60.97 124.2,60.97 126.84,58.33 126.84,26.52 U13.3 117.84,17.52 J11.2
D3
  Top 0.305: U13.4 122.68,24.77 126.19,28.28 126.19,58.1 123.95,60.33 118.49,60.33 116.84,61.99 116.84,74.3 110.36,80.78 109.98,80.78 | 109.47,80.78 99.44,80.78 98.6,81.62 J13.1 | J12.2 115.84,82.81 115.46,83.19 110.11,83.19 109.73,82.81 109.73,81.04 | 109.73,81.04 109.47,80.78 | 109.47,80.78 109.98,80.78 | 109.73,81.04 109.98,80.78
D4  (via drill 0.3 pad 0.64)
  Top 0.305: U13.5 122.68,27.31 125.5,30.13 125.5,57.9 123.7,59.7 118.24,59.7 116.2,61.73 116.2,74 110.05,80.15 96.26,80.15 | SW2.6 131.44,64.14 132.97,62.62 132.97,53.1 132.97,52.97 130.05,50.05 130.05,24.01 v129.54,23.5 | 96.26,80.15 95.88,80.15 | 95.88,80.15 95.76,80.15 | 95.76,80.15 84.2,80.15 83.36,80.99 J14.1 | J13.2 100.6,85.73 100.22,86.12 96.39,86.12 96.01,85.73 96.01,80.53 | 96.01,80.53 96.01,80.27 95.88,80.15 | 96.01,80.53 96.01,80.4 | 96.01,80.4 95.76,80.15 | 96.01,80.53 96.01,80.4 | 96.01,80.4 96.26,80.15
  Bottom 0.305: v129.54,23.5 125.73,27.31 U13.5
D5
  Top 0.254: U4.P$7 90.17,29.22 89.03,28.08 89.03,24.01 88.64,23.63 | J14.2 85.34,83.75 85.34,85.62 84.96,86 82.42,86 82.04,85.62 82.04,80.91 83.31,79.64 109.57,79.64 115.7,73.51 115.7,61.48 117.98,59.19 123.44,59.19 124.97,57.67 124.97,32.27 U13.6 112.39,19.69 90.19,19.69 88.64,21.24 88.64,23.38 | 88.64,23.5 88.64,23.38 | 42.67,17.28 42.8,17.28 47.12,21.6 71.75,21.6 73.66,23.5 88.52,23.5 | 88.64,23.63 88.64,23.5 | 88.64,23.5 88.52,23.5 | 88.52,23.5 88.64,23.63 | 88.52,23.5 88.64,23.38
  Top 0.305: D18.- 42.67,17.28
D6
  Top 0.254: U4.P$8 90.55,27.95 89.53,26.93 89.53,23.76 89.15,23.38 89.15,21.5 90.33,20.33 110.49,20.33 U13.7
D7  (via drill 0.3 pad 0.61)
  Top 0.254: U13.8 122.55,34.68 108.84,20.96 91.18,20.96 v89.91,22.23 90.04,22.36 90.04,26.17 90.55,26.68 U4.P$9 | D19.- 47.75,17.28 51.43,20.96 74.93,20.96 76.2,22.23 v87.88,22.23
  Bottom 0.254: v89.91,22.23 v87.88,22.23
D8  (via drill 0.3 pad 0.64)
  Top 0.254: 111.38,27.95 U4.P$13 113.03,27.95 120.01,34.93 120.01,36.46 U13.9 | v118.87,42.68 118.87,56.78 114.68,60.97 114.68,72.91 108.96,78.62 65.4,78.62 59.93,73.15 46.49,73.15 46.36,73.28 D20.-
  Bottom 0.254: U13.9 120.52,39 118.87,40.65 v118.87,42.68
D9
  Top 0.254: U4.P$14 113.28,29.22 119.38,35.32 119.38,38.36 U13.10
D10
  Top 0.254: U4.P$15 113.41,30.49 118.62,35.7 118.62,40.14 U13.11 124.46,45.98 124.46,57.41 123.19,58.68 117.73,58.68 115.19,61.22 115.19,73.16 109.22,79.13 64.9,79.13 59.45,73.68 51.04,73.68 50.91,73.81 D21.-
GND  (via drill 0.3 pad 0.64)
  Top 0.305: U7.4 107.15,48.86 v107.63,49.35 | U7.7 105.85,51.37 v105.09,50.62 | C19.2 R41.1 | U5.6 103.56,68.9 v102.87,68.21
  other vias: 69.85,73.03 72.39,73.03 74.93,73.03 74.93,71.13 72.39,71.13 69.85,71.13 69.85,69.22 72.39,69.22 74.93,69.22 100.33,70.24 102.87,70.24 100.33,68.21 101.6,69.22 89.53,62.87 91.44,62.87 98.42,63.51 100.96,63.51 110.49,72.4 110.49,70.49 110.49,68.84 88.9,75.57 92.71,75.57 91.44,60.33 85.72,57.79 85.72,53.98 85.72,51.44 86.36,46.36 90.17,46.36 92.71,46.36 100.01,52.52 100.07,49.48 100.01,46.36 95.25,46.36 98.42,46.36 107.63,46.17 109.79,46.17 95.25,60.33 99.06,60.33 102.87,60.33 106.68,60.33 110.49,60.33 114.3,55.89 114.3,53.35 107.31,75.57 86.99,75.57 86.99,73.67 86.99,71.76 86.99,69.86 90.8,81.86 104.77,81.99 123.82,81.92 83.18,36.14 83.12,33.66 83.12,31.12 83.12,28.58 107.25,23.5 107.25,22.23 108.52,22.23 108.52,23.5 109.79,34.93 109.79,40.01 83.31,7.38 112.39,15.82 133.35,26.31 136.52,26.31 139.7,26.31 139.7,23.5 136.52,23.5 133.35,23.5 90.8,75.57 60.32,78.75 50.8,78.75 25.4,78.75 25.4,18.42 50.8,18.42 60.32,18.42 140.33,76.21 136.52,76.21 132.71,76.21 156.21,64.78 154.3,66.68 160.65,53.98 158.75,53.98 153.03,42.55 149.86,42.55 150.49,31.12 153.03,31.12 157.48,62.81 147.95,31.12 140.98,72.38 128.9,76.21 155.57,53.98 153.67,53.98 153.67,49.54 155.57,42.55 155.57,31.12 157.48,31.76 155.57,29.22 153.03,29.22 150.49,29.22 147.95,34.3 144.78,36.84 147.95,36.84 147.95,29.22 158.11,42.55 158.11,40.01 140.98,67.94 132.71,67.95 34.29,78.75 34.29,18.42 125.09,76.21 121.28,76.21 117.47,76.21 133.35,19.69 136.52,19.69 139.7,19.69
  pour Top: 73.01,99.07 74.28,99.07 74.28,97.8 73.01,97.8
  pour Top (isolate 0.406, rank 6, no thermals): -2.54,94.62 168.27,94.62 168.27,-0.63 -2.54,-0.63
  pour Bottom (isolate 0.406, rank 6, no thermals): -2.54,94.62 168.27,94.62 168.27,-0.63 -2.54,-0.63
GREF
  Top 0.406: 135.51,52.33 135.51,72.15 135.76,72.4 U3.3 | 135.51,52.33 135.51,51.83 | 135.51,51.83 135.51,40.56 R4.3 134.86,39.91 U2.5 137.73,31.65 139,30.38 U2.3 | 135.76,52.08 135.51,51.83 | 135.76,52.08 135.51,52.33 | 135.76,52.08 154.18,52.08 156.34,49.92 156.34,48.02 156.08,47.76 C13.2 155.19,47.63 U1.3 151.76,47.63 150.49,48.9 U1.5
LINE-FINDER-1  (via drill 0.3 pad 0.64)
  Top 0.406: R5.1 v144.78,53.98 | v137.48,27.84 U2.1 140.11,27.82 140.71,27.82 142.3,26.23 142.3,24.33 142.73,23.9 D1.-
  Bottom 0.406: v144.78,53.98 147.57,51.19 147.57,40.52 147.06,40.01 143.26,40.01 135.77,32.52 135.77,29.54 v137.48,27.84
LINE-FINDER-2  (via drill 0.3 pad 0.61, 0.3 pad 0.64)
  Top 0.406: U2.7 v137.48,29.11 | R9.1 v144.78,56.52 | D2.- 151.26,35.06 150.37,35.95 150.37,37.09 v148.33,39.13
  Bottom 0.406: v137.48,29.11 136.61,29.97 136.61,31.97 143.77,39.13 v148.33,39.13 148.33,52.97 v144.78,56.52
LINE-FINDER-3  (via drill 0.3 pad 0.64)
  Top 0.406: D3.- 157.61,45.09 U1.1 151.38,45.09 v150.75,45.73 | R13.1 146.3,59.06 v150.75,54.62
  Bottom 0.406: v150.75,54.62 v150.75,45.73
LINE-FINDER-4  (via drill 0.3 pad 0.64)
  Top 0.406: U1.7 v149.86,46.36 | R19.1 146.68,61.6 v149.1,59.19 150.87,57.41 D4.-
  Bottom 0.406: v149.86,46.36 149.08,47.15 149.08,59.17 v149.1,59.19
LINE-FINDER-5
  Top 0.406: 143.76,64.14 R22.1 143.91,64.41 D5.- 143.89,68.59 143.19,68.59 141.92,69.86 U3.1
LIPO-7V4  (via drill 0.38 pad 0.81)
  Top 0.61: D7.- v86.99,34.93 | U4.P$6 88.39,30.49 C6.2 87.76,27.82 | 87.76,27.82 87.76,27.25 C8.+ | v86.36,27.82 87.76,27.82
  Top 1.016: v75.31,50.81 81.09,50.81 82.93,48.97 82.93,44.59 85.47,42.05 v86.87,42.05 88.14,42.05 | 88.14,42.05 88.9,42.05 | 88.9,42.05 89.15,42.05 | 89.15,42.05 v113.54,42.05 | v113.54,32.39 D8.- | D9.- v113.54,37.47 | D6.- 88.64,41.79 88.9,42.05 | 88.14,42.05 88.64,41.54 89.15,42.05
  Top 1.27: 15.35,60.78 15.35,61.08 15.87,61.6 | 15.87,61.6 23.2,68.94 30.13,68.94 33.02,66.05 33.02,59.7 34.92,57.79 68.45,57.79 72.01,61.35 v75.31,61.35 78.99,61.35 80.26,62.62 D14.+ | 15.87,61.6 14.86,61.6 | 15.87,61.6 15.87,60.33
  Top 1.524: SW1.COM2 16.35,59.78 15.35,60.78 SW1.COM1
  Bottom 0.61: v86.87,42.05 86.99,41.92 86.99,35.06 v86.99,34.93 86.99,28.46 v86.36,27.82
  Bottom 1.016: v75.31,61.35 v75.31,50.81 | v113.54,42.05 v113.54,37.47 v113.54,32.39
LIPO-OUT-7V4
  Top 0.406: U5.2 97.48,69.55 96.01,68.08 Q3.3
  Top 1.27: C25.+ 89.53,68.21 | SW1.CH2A 21.67,61.73 F1.1
  Top 2.032: 89.53,68.21 88.07,68.21 86.99,67.13 86.99,63.76 80.9,57.67 72.9,57.67 69.41,54.18 27.74,54.18 23.24,58.68 F1.1
  Bottom 1.524: SW1.CH2A | SW1.CH1A 17.98,61.73 SW1.CH2A | SW1.CH2A
  pour Top (isolate 0.254, no thermals): 95.5,67.45 88.64,67.45 88.64,69.03 95.5,69.03
N$1
  Top 0.305: R28.1 44.32,17.03 D18.+
N$2  (via drill 0.3 pad 0.61)
  Top 0.406: U2.2 141.49,29.11 R1.1 142.25,27.58 v142.64,27.2
  Bottom 0.406: v142.64,27.2 145.19,24.65 148.48,24.65 S1.3
N$3  (via drill 0.3 pad 0.61)
  Top 0.406: 151.38,39.38 R6.1 151.38,39.25 152.91,37.73 152.91,36.13 S2.3 | U2.6 v137.48,30.38
  Bottom 0.406: v137.48,30.38 137.48,31.44 144.27,38.24 150.8,38.24 S2.3
N$4
  Top 0.406: D2.+ 151.38,37.86 R8.2
N$5
  Top 0.406: R2.2 145.56,24.84 S1.2
N$6
  Top 0.406: R7.2 154.83,39.51 S2.2
N$7
  Top 0.305: R29.1 49.4,17.03 D19.+
N$8  (via drill 0.3 pad 0.61)
  Top 0.406: U1.2 156.46,46.36 v157.1,47 R10.1
  Bottom 0.406: v157.1,47 163.32,47 164.57,48.25 S3.3
N$9
  Top 0.406: R12.2 D3.+
N$10
  Top 0.406: R11.2 160.4,47.14 S3.2
N$11
  Top 0.406: R30.1 D20.+
N$12
  Top 0.406: R3.2 D1.+
N$13
  Top 0.406: S4.2 156.06,60.59 154.3,60.59 R15.2
N$14
  Top 0.406: D4.+ 149.73,60.59 R16.2
N$15
  Top 0.61: SW2.1 R5.2
N$16
  Top 2.032: J5.1 24.92,64.87 27.56,62.24 F1.2
N$17
  Top 0.61: SW2.2 R9.2
N$18
  Top 0.406: D5.+ R20.2
N$19
  Top 0.406: R18.2 145.43,69.61 S5.2
N$20  (via drill 0.3 pad 0.61)
  Top 0.406: R17.1 v142.25,71.11 142.24,71.13 U3.2
  Bottom 0.406: v142.25,71.11 144.03,69.34 148.53,69.34 S5.3
N$21
  Top 0.61: SW2.3 R13.2
N$22
  Top 0.61: SW2.4 R19.2
N$23
  Top 0.61: SW2.5 R22.2
N$25
  Top 0.61: R21.1 15.49,38.18 D16.+
N$28
  Top 0.406: R31.1 D21.+
N$31
  Top 0.406: R23.1 D15.+
N$32
  Top 0.406: U5.1 98.7,72.25 97.41,73.54 R39.2
  Top 1.016: Q3.2 94.17,72.85 R39.2
N$33  (via drill 0.3 pad 0.64)
  Top 0.406: U1.6 v149.86,47.63 | R14.1 151.38,60.72 154.44,57.65 S4.3
  Bottom 0.406: S4.3 150.88,56.91 149.86,55.88 v149.86,47.63
N$35  (via drill 0.3 pad 0.64)
  Top 0.406: Q3.1 96.14,70.11 v97.15,71.13 | U5.7 105.61,69.55 106.55,70.49 R33.2 106.55,72.27 v106.68,72.4
  Bottom 0.406: v97.15,71.13 98.42,72.4 v106.68,72.4
N$36
  Top 0.406: D23.- 108.08,66.3 109.6,64.78 R35.2
N$37
  Top 0.406: U5.4 98.7,67.55 R36.2 R38.1
N$38
  Top 0.406: D24.- 107.95,64.78 106.55,66.18 D23.+ 106.55,68.08 | 106.55,68.08 106.55,68.21 | 106.55,68.21 106.55,68.4 | 106.55,68.4 R34.2 | U5.5 106.38,68.25 | 106.4,68.25 106.51,68.25 106.55,68.21 | 106.38,68.25 106.4,68.25 | 106.4,68.25 106.55,68.4 | 106.38,68.25 106.55,68.08
N$39
  Top 0.406: R37.1 104.52,66.3 106.04,64.78 D24.+
N$41
  Top 0.406: C18.1 105,51.83 U7.8
N$42
  Top 0.406: U7.2 105.85,48.21 105.41,48.65 R41.2 103.5,48.78 R40.2
N$43
  Top 0.406: U7.5 107.15,54.28 105.79,55.64 105.79,56.5 L1.1 105.81,57.13 105.79,57.16 104.72,58.23 D22.+
  pour Top (isolate 0.254, no thermals): 107.06,51.51 107.69,51.51 107.69,59.19 arc90 107.44,59.45 101.22,59.45 arc90 100.96,59.19 100.96,57.41 arc90 101.22,57.16 104.52,57.16 arc-90 104.77,56.91 104.77,53.35 arc90 105.03,53.1 106.81,53.1 arc-90 107.06,52.84
N$44
  Top 0.406: U7.1 105.2,45.9 104.77,45.48 R32.1
N$45
  Top 0.406: R32.2 C19.1
N$50
  Top 1.016: D14.- 84.45,65.67 81.98,68.14 C11.+ 81.85,68.84 U6.1
OUT1  (via drill 0.38 pad 0.81)
  Top 0.61: U4.P$4 90.55,33.03 90.04,33.54 90.04,36.08 D13.- 88.26,37.47 85.72,40.01 D6.+ 78.48,33.16 55.75,33.16 v55.24,33.66
  Bottom 0.61: v55.24,33.66 55.24,36.17 M1.2
OUT2  (via drill 0.38 pad 0.81)
  Top 0.61: U4.P$5 89.28,31.76 D12.- 87.88,32.39 D7.+ 81.91,34.93 79.1,32.12 37.73,32.12 v36.19,33.66
  Bottom 0.813: v36.19,33.66 36.19,36.2 37.46,37.47 37.85,37.47 M1.1
OUT3  (via drill 0.38 pad 0.81)
  Top 0.61: U4.P$16 107.57,31.76 D8.+ 108.58,32.39 111.12,34.93 D11.- 116.2,34.93 117.85,36.59 117.85,56.65 113.92,60.59 113.92,72.65 108.58,77.99 69.09,77.99 v55.24,64.14
  Bottom 0.61: v55.24,64.14 55.24,57.16 54.18,56.1 M2.1
OUT4  (via drill 0.38 pad 0.81)
  Top 0.61: U4.P$17 106.3,33.03 106.68,33.41 106.68,35.95 D9.+ 108.71,37.47 111.25,40.01 D10.- 116.08,40.01 116.71,40.65 116.71,56.14 112.9,59.95 112.9,72.02 108.08,76.84 69.85,76.84 53.34,60.33 v36.19,60.33
  Bottom 0.61: v36.19,60.33 36.19,57.16 37.46,55.89 38.07,55.89 M2.2
OUTPUT
  Top 0.61: R40.1 101.98,53.19 arc-45 102.05,53.37 D22.-
  Top 0.813: D22.- 98.63,53.81 97.66,52.84 C1.+ 96.39,52.08 C20.1 C17.1 L2.1
OUTPUT2
  Top 0.813: D25.+ 92.91,53.73 90.04,53.73 89.03,52.71 C23.+ C21.1 C22.1 93.85,49.92 L2.2
PAD  (via drill 0.3 pad 0.64)
  other vias: 93.34,38.74 95.88,38.74 98.42,38.74 100.96,38.74 103.5,38.74 93.34,36.2 95.88,36.2 98.42,36.2 100.96,36.2 103.5,36.2 103.5,33.66 100.96,33.66 98.42,33.66 95.88,33.66 93.34,33.66 93.34,31.12 95.88,31.12 98.42,31.12 100.96,31.12 103.5,31.12 103.5,28.58 100.96,28.58 98.42,28.58 95.88,28.58 93.34,28.58 93.34,26.04 95.88,26.04 93.34,23.5 95.88,23.5 98.42,23.5 98.42,26.04 100.96,26.04 100.96,23.5 103.5,23.5 103.5,26.04
  pour Top (isolate 0.254, no thermals): 93.08,39 103.75,39 103.75,23.25 93.08,23.25
  pour Bottom (isolate 0.254, no thermals): 90.79,41.28 106.03,41.28 106.03,21.6 90.79,21.6
RES
  Top 0.305: 69.56,35.28 69.59,35.32 | 69.59,35.32 73.02,38.74 75.56,38.74 76.07,39.25 76.07,45.86 U13.28 | 69.59,35.32 18.22,35.32 D16.- 15.68,32.91 K1.P$1
USB-5V
  Top 0.406: J6.1 14.6,48.57 D17.+ 15.44,49.21 18.41,46.24 18.41,43.19 20.95,40.65 67.31,40.65 69.85,43.19 69.85,50.81 74.29,55.25 81.02,55.25 87.37,61.6 103.5,61.6 104.39,62.49 R37.2
  pour Top (isolate 0.254, no thermals): 9.14,49.54 15.24,49.54 15.24,48.52 9.14,48.52
VCC-9V  (via drill 0.38 pad 0.81)
  Top 0.406: R38.2 102.11,63.26 101.22,62.37 96.39,62.37 95.5,63.26 C24.+ | U5.8 104.5,73.25 | 104.5,73.25 104.5,73.27 104.77,73.54 | 104.5,73.25 104.27,73.48 | U5.3 97.84,68.9 97.28,68.34 97.28,67.83
  Top 0.61: R39.1 104.77,73.54 107.57,73.54 108.08,73.03 R33.1 | 97.28,67.83 97.28,66.68 | 97.28,66.68 97.28,66.43 97.15,66.3 | 97.28,66.68 96.9,66.3 | 97.28,66.68 97.79,66.18
  Top 0.813: C9.2 97.15,66.3 96.9,66.3 95.63,66.3 95.5,66.18 C24.+
  Top 1.016: C24.+ v93.09,65.54 | v93.09,59.95 D25.- | v99.19,73.54 R39.1
  Bottom 1.016: v93.09,59.95 v93.09,65.54 93.09,68.87 97.76,73.54 v99.19,73.54

### Text on the board
tPlace: D4 | D5 | 5V | GND | D3 | D4 | 5V | GND | D2 | D3 | 5V | GND | - | ON | + | J7 | OFF | RESET | J1 | 5V | D2 | D1 | GND | J3 | J8 | J4 | GND | 5V | 5V | TX | RX | GND | 5V | SDA | SCL
bPlace: Duino Bot v1.0